# Altium schematic sheet 12_B_TO_B.SchDoc: V5_CORE_B_TO_B-CON
size A4; CompanyName: CUAV Ltd; DrawnBy: bin
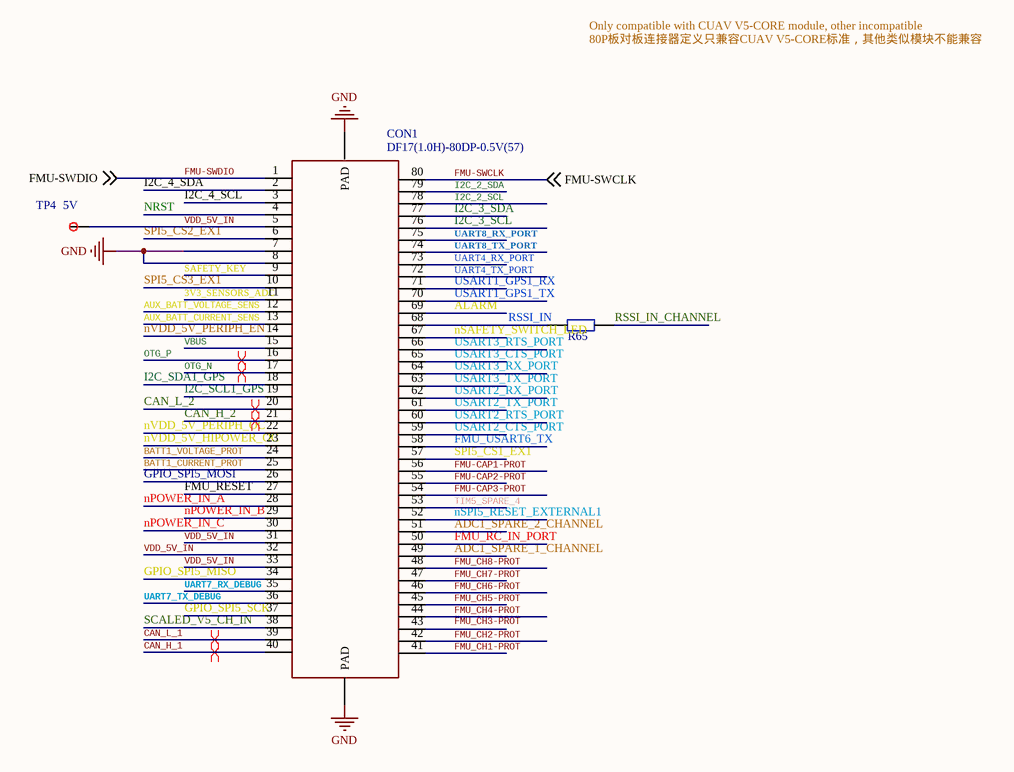
[diagram p0: 12_B_TO_B.SchDoc]

## Parts
CON1  DF17(1.0H)-80DP-0.5V(57)  [DF17(1.0H)-80DP-0.5V(57)]
R65  0402R100R  [0402R]  (value not drawn)
TP4  5V  [TP0.75]

## Nets
GND: CON1.7 CON1.8 CON1.PAD
3V3_SENSORS_ADC: CON1.11
ADC1_SPARE_1_CHANNEL: CON1.49
ADC1_SPARE_2_CHANNEL: CON1.51
ALARM: CON1.69
AUX_BATT_CURRENT_SENS: CON1.13
AUX_BATT_VOLTAGE_SENS: CON1.12
BATT1_CURRENT_PROT: CON1.25
BATT1_VOLTAGE_PROT: CON1.24
CAN_H_1: CON1.40
CAN_H_2: CON1.21
CAN_L_1: CON1.39
CAN_L_2: CON1.20
FMU-CAP1-PROT: CON1.56
FMU-CAP2-PROT: CON1.55
FMU-CAP3-PROT: CON1.54
FMU-SWCLK: CON1.80 ; off-sheet FMU-SWCLK
FMU-SWDIO: CON1.1 ; off-sheet FMU-SWDIO
FMU_CH1-PROT: CON1.41
FMU_CH2-PROT: CON1.42
FMU_CH4-PROT: CON1.44
FMU_CH5-PROT: CON1.45
FMU_CH6-PROT: CON1.46
FMU_CH7-PROT: CON1.47
FMU_CH8-PROT: CON1.48
FMU_RC_IN_PORT: CON1.50
FMU_RESET: CON1.27
FMU_USART6_TX: CON1.58
GPIO_SPI5_MISO: CON1.34
GPIO_SPI5_MOSI: CON1.26
GPIO_SPI5_SCK: CON1.37
I2C_2_SCL: CON1.78
I2C_2_SDA: CON1.79
I2C_3_SCL: CON1.76
I2C_3_SDA: CON1.77
I2C_4_SCL: CON1.3
I2C_4_SDA: CON1.2
I2C_SCL1_GPS: CON1.19
I2C_SDA1_GPS: CON1.18
nPOWER_IN_A: CON1.28
nPOWER_IN_B: CON1.29
nPOWER_IN_C: CON1.30
NRST: CON1.4
nSAFETY_SWITCH_LED: CON1.67
nSPI5_RESET_EXTERNAL1: CON1.52
nVDD_5V_HIPOWER_OC: CON1.23
nVDD_5V_PERIPH_EN: CON1.14
nVDD_5V_PERIPH_OC: CON1.22
OTG_N: CON1.17
OTG_P: CON1.16
RSSI_IN: CON1.68 R65.2
RSSI_IN_CHANNEL: R65.1
SAFETY_KEY: CON1.9
SCALED_V5_CH_IN: CON1.38
SPI5_CS1_EX1: CON1.57
SPI5_CS2_EX1: CON1.6
SPI5_CS3_EX1: CON1.10
TIM5_SPARE_4: CON1.53
UART4_RX_PORT: CON1.73
UART4_TX_PORT: CON1.72
UART7_RX_DEBUG: CON1.35
UART7_TX_DEBUG: CON1.36
UART8_RX_PORT: CON1.75
UART8_TX_PORT: CON1.74
USART1_GPS1_RX: CON1.71
USART1_GPS1_TX: CON1.70
USART2_CTS_PORT: CON1.59
USART2_RTS_PORT: CON1.60
USART2_RX_PORT: CON1.62
USART2_TX_PORT: CON1.61
USART3_CTS_PORT: CON1.65
USART3_RTS_PORT: CON1.66
USART3_RX_PORT: CON1.64
USART3_TX_PORT: CON1.63
VBUS: CON1.15
VDD_5V_IN: CON1.5 CON1.31 CON1.32 CON1.33 TP4.0

Not connected (* = marked no-connect by the designer): CON1 43

## Layout directives
differential pair: CAN_H_1, CAN_H_2, CAN_L_1, CAN_L_2, OTG_N, OTG_P

## Notes on the sheet
- Labels drawn without touching a wire or pin: 80P板对板连接器定义只兼容CUAV V5-CORE标准，其他类似模块不能兼容, FMU_CH3-PROT, Only compatible with CUAV V5-CORE module, other incompatible
- Title
- Size:
- Date:
- A4
- Number:
- Time:
- Revision:
- Sheet
- of
- DrawnBy:

## Library data of the parts
R65 = 0402R100R: 0402R100R 1%
TP4 = TP_0.75: TP_0.75MM